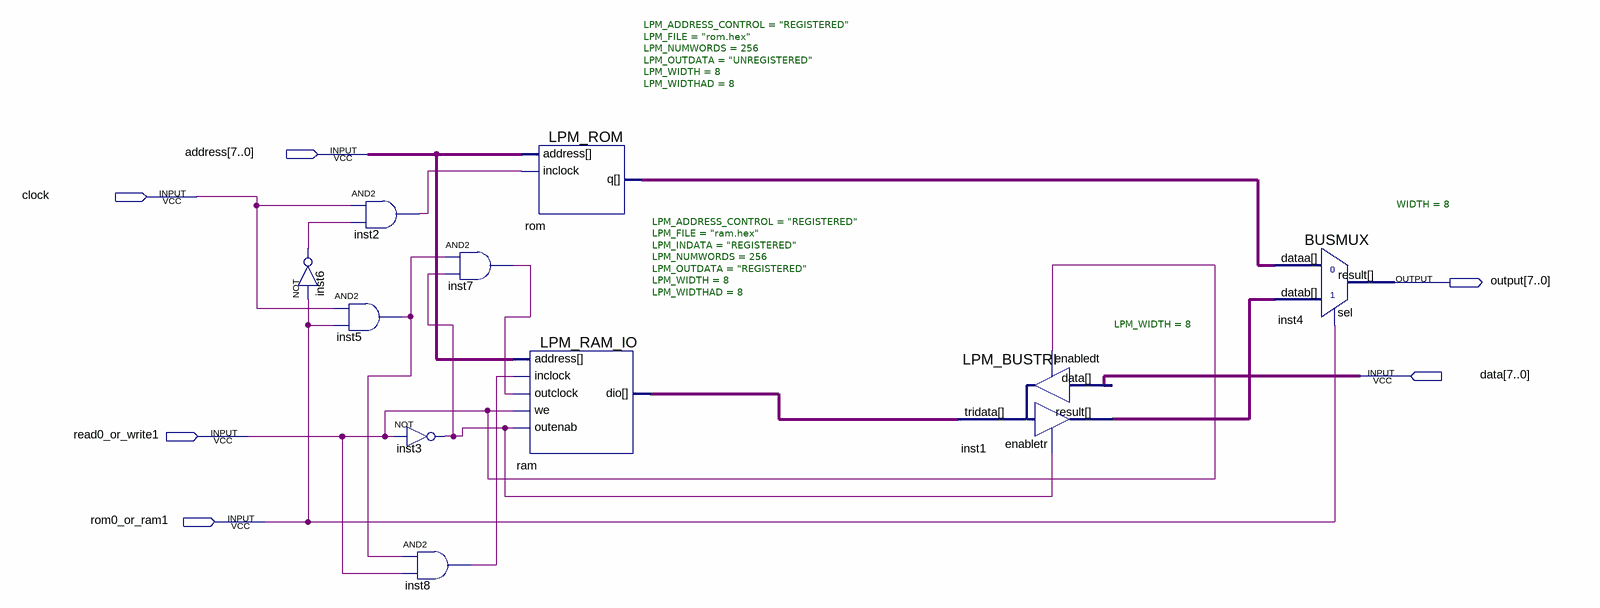
[diagram p0: schematic sheet]
// Quartus schematic memory.bdf as structural Verilog: 10 symbols, 6 pins
module memory (
  input  [7:0] address,
  input  clock,
  input  [7:0] data,
  input  read0_or_write1,
  input  rom0_or_ram1,
  output [7:0] \output 
);

  wire inst2_out, inst3_out, inst5_out, inst6_out, inst7_out, inst8_out;
  wire [7:0] inst1_result, ram_dio, rom_q;

  not inst6 (inst6_out, rom0_or_ram1);
  and inst2 (inst2_out, clock, inst6_out);
  and inst5 (inst5_out, clock, rom0_or_ram1);
  not inst3 (inst3_out, read0_or_write1);
  and inst8 (inst8_out, inst5_out, read0_or_write1);
  and inst7 (inst7_out, inst5_out, inst3_out);
  LPM_ROM #(.LPM_ADDRESS_CONTROL("REGISTERED"), .LPM_FILE("rom.hex"), .LPM_NUMWORDS(256), .LPM_OUTDATA("UNREGISTERED"), .LPM_WIDTH(8), .LPM_WIDTHAD(8)) rom (
    .address(address), .inclock(inst2_out), .q(rom_q));
  LPM_RAM_IO #(.LPM_ADDRESS_CONTROL("REGISTERED"), .LPM_FILE("ram.hex"), .LPM_INDATA("REGISTERED"), .LPM_NUMWORDS(256), .LPM_OUTDATA("REGISTERED"), .LPM_WIDTH(8), .LPM_WIDTHAD(8)) ram (
    .address(address), .outclock(inst7_out), .inclock(inst8_out), .we(read0_or_write1), .outenab(inst3_out),
    .dio(ram_dio));
  LPM_BUSTRI #(.LPM_WIDTH(8)) inst1 (
    .data(data), .enabledt(read0_or_write1), .enabletr(inst3_out), .result(inst1_result), .tridata(ram_dio));
  BUSMUX #(.WIDTH(8)) inst4 (.datab(inst1_result), .sel(rom0_or_ram1), .dataa(rom_q), .result(\output ));
endmodule
